# Altium schematic sheet POWER.SchDoc: ZoM Mod A - Power
size A4; Organization: Trenz Electronic GmbH; DocumentNumber: 13; Revision: 01; SheetNumber: 13; SheetTotal: 13; Date: 12/16/2014
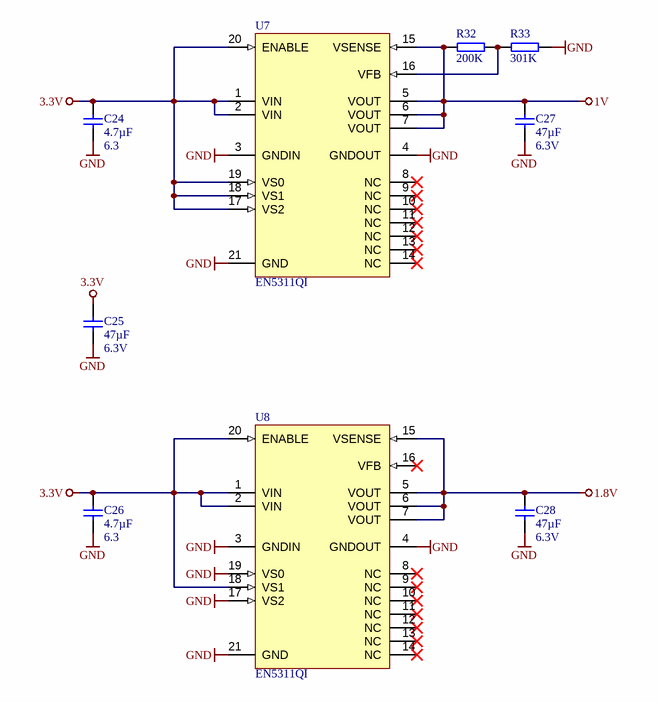
[diagram p0: POWER.SchDoc]

## Parts
C24  4.7µF  Voltage: 6.3  [CAPC1005X60N]
C25  47µF  Voltage: 6.3V  [CAPC3216X180N]
C26  4.7µF  Voltage: 6.3  [CAPC1005X60N]
C27  47µF  Voltage: 6.3V  [CAPC3216X180N]
C28  47µF  Voltage: 6.3V  [CAPC3216X180N]
R32  200K  [RESC1005X40N]
R33  301K  [RESC1005X40N]
U7  EN5311QI  [EN5311QI]
U8  EN5311QI  [EN5311QI]

## Nets
1.8V: C28.1 U8.5(VOUT) U8.6(VOUT) U8.7(VOUT) U8.15(VSENSE)
1V: C27.1 R32.1 U7.5(VOUT) U7.6(VOUT) U7.7(VOUT) U7.15(VSENSE)
3.3V: C24.1 C25.1 C26.1 U7.1(VIN) U7.2(VIN) U7.17(VS2) U7.18(VS1) U7.19(VS0) U7.20(ENABLE) U8.1(VIN) U8.2(VIN) U8.18(VS1) U8.20(ENABLE)
GND: C24.2 C25.2 C26.2 C27.2 C28.2 R33.2 U7.3(GNDIN) U7.4(GNDOUT) U7.21(GND) U8.3(GNDIN) U8.4(GNDOUT) U8.17(VS2) U8.19(VS0) U8.21(GND)
NetR32_2: R32.2 R33.1 U7.16(VFB)

Not connected (* = marked no-connect by the designer): U7 8(NC)* 9(NC)* 10(NC)* 11(NC)* 12(NC)* 13(NC)* 14(NC)*; U8 8(NC)* 9(NC)* 10(NC)* 11(NC)* 12(NC)* 13(NC)* 14(NC)* 16(VFB)*

## Notes on the sheet
- Title:
- Number:
- Rev.
- Date:
- A4
- Copyright:
- Page
- of
- Filename:

## Library data of the parts
C24 C26 = 24719: KON 4.7µF 6.3V X5R SMD; AN: 24719; Mixed: SMT; Value: 4.7u; Preferred: Yes; Technology: X5R; Case: 1005 (0402)
C25 C27 C28 = 24557: KON 47µF 6.3V  X5R SMD 20%; AN: 24557; Mixed: SMT; Value: 47u; Preferred: Yes; Technology: X5R; Case: 3216 (1206); Tolerance: 20%
R32 = 23846: WID SMD 200K 1% 0,063W; AN: 23846; Mixed: SMT; Preferred: Yes; Case: 1005 (0402); Value: 200K
R33 = 26224: WID SMD 301K 1% 0,063W; AN: 26224; Mixed: SMT; Tolerance: 1%; Case: 1005 (0402); Value: 301k
U7 U8 = 25492: AN: 25492; Mixed: SMT; Trenz-Stock: Yes; Case: QFN20; HelpURL: B:\AD\adlib\datasheet\EN5311QI; Preferred: Yes